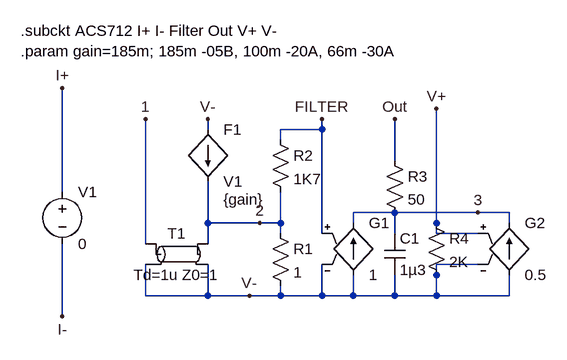
[diagram p0: schematic ACS712.asc]
ACS712.asc, the LTspice schematic file:
Version 4
SHEET 1 1848 680
WIRE 624 -48 624 -64
WIRE 800 -48 800 -64
WIRE 800 -48 736 -48
WIRE 736 -32 736 -48
WIRE 912 0 912 -64
WIRE 400 48 400 -112
WIRE 912 80 848 80
WIRE 1040 80 912 80
WIRE 1088 80 1040 80
WIRE 624 96 624 32
WIRE 704 96 624 96
WIRE 736 96 736 48
WIRE 736 96 704 96
WIRE 848 96 848 80
WIRE 976 96 976 -80
WIRE 1088 96 1088 80
WIRE 736 112 736 96
WIRE 800 112 800 -48
WIRE 912 112 912 80
WIRE 976 112 976 96
WIRE 1040 112 976 112
WIRE 528 128 528 -64
WIRE 624 128 624 96
WIRE 1040 160 976 160
WIRE 976 176 976 160
WIRE 528 208 528 160
WIRE 624 208 624 160
WIRE 624 208 528 208
WIRE 688 208 624 208
WIRE 736 208 736 192
WIRE 736 208 688 208
WIRE 800 208 800 160
WIRE 800 208 736 208
WIRE 848 208 848 176
WIRE 848 208 800 208
WIRE 912 208 912 176
WIRE 912 208 848 208
WIRE 976 208 976 176
WIRE 976 208 912 208
WIRE 1088 208 1088 176
WIRE 1088 208 976 208
WIRE 400 240 400 128
FLAG 400 -112 I+
FLAG 400 240 I-
FLAG 624 -64 V-
FLAG 528 -64 1
FLAG 704 96 2
FLAG 800 -64 FILTER
FLAG 912 -64 Out
FLAG 976 -80 V+
FLAG 688 208 V-
FLAG 1040 80 3
SYMBOL voltage 400 32 R0
SYMATTR InstName V1
SYMATTR Value 0
SYMBOL f 624 -48 R0
WINDOW 123 24 108 Left 2
SYMATTR Value2 {gain}
SYMATTR InstName F1
SYMATTR Value V1
SYMBOL tline 576 144 R0
SYMATTR InstName T1
SYMATTR Value Td=1u Z0=1
SYMBOL res 720 96 R0
SYMATTR InstName R1
SYMATTR Value 1
SYMBOL res 720 -48 R0
SYMATTR InstName R2
SYMATTR Value 1K7
SYMBOL g 848 80 R0
SYMATTR InstName G1
SYMATTR Value 1
SYMBOL cap 896 112 R0
SYMATTR InstName C1
SYMATTR Value 1µ3
SYMATTR SpiceLine Rpar=1
SYMBOL res 896 -16 R0
SYMATTR InstName R3
SYMATTR Value 50
SYMBOL g 1088 80 R0
SYMATTR InstName G2
SYMATTR Value 0.5
SYMBOL res 960 80 R0
SYMATTR InstName R4
SYMATTR Value 2K
TEXT 336 -200 Left 2 !.subckt ACS712 I+ I- Filter Out V+ V-\n.param gain=185m; 185m -05B, 100m -20A, 66m -30A

The netlist it stands for:
* ACS712.asc
V1 I+ I- 0
F1 V- 2 V1 {gain}
T1 1 V- 2 V- Td=1u Z0=1
R1 2 V- 1
R2 FILTER 2 1K7
G1 V- 3 FILTER V- 1
C1 3 V- 1µ3 Rpar=1
R3 Out 3 50
G2 V- 3 V+ V- 0.5
R4 V+ V- 2K
.subckt ACS712 I+ I- Filter Out V+ V-
.param gain=185m; 185m -05B, 100m -20A, 66m -30A
.backanno
.end